# Altium schematic sheet Power_Ctrl.SchDoc
size B
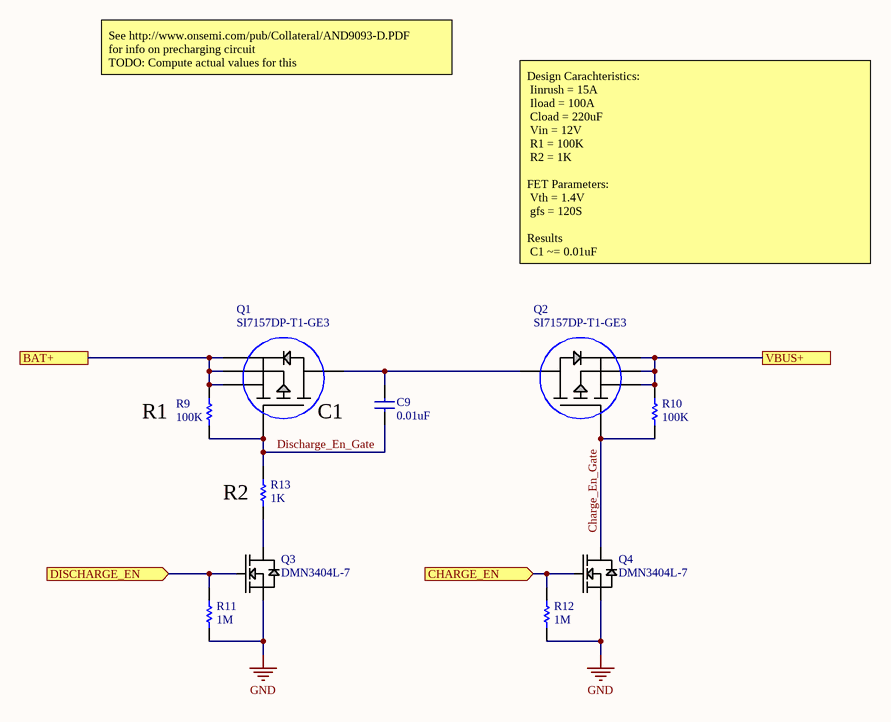
[diagram p0: Power_Ctrl.SchDoc]

## Parts
C9  value 0.01uF  [0805_Capacitor]  (hidden comment: CAP 0.01uF 50V X7R)
Q1  SI7157DP-T1-GE3  [SO-8_PowerPAK(S)]
Q2  SI7157DP-T1-GE3  [SO-8_PowerPAK(S)]
Q3  DMN3404L-7  [SOT23-3]
Q4  DMN3404L-7  [SOT23-3]
R9  value 100K  [0603_RESISTOR]  (hidden comment: R_0603_100K_1%)
R10  value 100K  [0603_RESISTOR]  (hidden comment: R_0603_100K_1%)
R11  value 1M  [0603_RESISTOR]  (hidden comment: R_0603_1M_1%)
R12  value 1M  [0603_RESISTOR]  (hidden comment: R_0603_1M_1%)
R13  value 1K  [0603_RESISTOR]  (hidden comment: R_0603_1K_1%)

## Ports
BAT+, CHARGE_EN (in), DISCHARGE_EN (in), VBUS+

## Nets
GND: Q3.2(SOURCE) Q4.2(SOURCE) R11.1 R12.1
BAT+: Q1.1(SOURCE) Q1.2(SOURCE) Q1.3(SOURCE) R9.2 ; port BAT+
CHARGE_EN: Q4.1(GATE) R12.2 ; port CHARGE_EN
Charge_En_Gate: Q2.4(GATE) Q4.3(DRAIN) R10.2
DISCHARGE_EN: Q3.1(GATE) R11.2 ; port DISCHARGE_EN
Discharge_En_Gate: C9.2 Q1.4(GATE) R9.1 R13.2
VBUS+: Q2.1(SOURCE) Q2.2(SOURCE) Q2.3(SOURCE) R10.1 ; port VBUS+
NetC9_1: C9.1 Q1.5(DRAIN) Q2.5(DRAIN)
NetQ3_3: Q3.3(DRAIN) R13.1

## Notes on the sheet
- See http://www.onsemi.com/pub/Collateral/AND9093-D.PDF
  for info on precharging circuit
  TODO: Compute actual values for this
- Design Carachteristics:
  Iinrush = 15A
  Iload = 100A
  Cload = 220uF
  Vin = 12V
  R1 = 100K
  R2 = 1K
  FET Parameters:
  Vth = 1.4V
  gfs = 120S
  Results
  C1 ~= 0.01uF
- (near R9) R1
- (near Q1) C1
- (near R13) R2

## Library data of the parts
C9 = C_0805_0.01uF_50V_10%: CAP CERM 0.01uF 10% 50V 0805; SVP Creator: Spencer Berglund; Package: =SelectedPackage; Voltage: 50V; Temperature Coefficient: X7R; Supplier 1: Digi-Key; Supplier Part Number 1: 1276-1078-1-ND
Q1 Q2 = Q_SI7157DP-T1-GE3: P-Channel 20V 60A (Tc) 6.25W (Ta), 104W (Tc) Surface Mount PowerPAK® SO-8; Turn-On Delay Time: 20ns; Gate to Source Voltage (Vgs): 12V; Number of Elements: 1; Rise Time: 14ns; Turn-Off Delay Time: 220ns; Drain to Source Resistance: 1.25mR; Drain to Source Breakdown Voltage: -20V; Threshold Voltage: -1.4V; Element Configuration: Single; Rds On Max: 1.6mR; Input Capacitance: 22nF; Fall Time: 55ns; Continuous Drain Current (ID): -60A; Supplier 1: Digi-Key; Supplier Part Number 1: SI7157DP-T1-GE3CT-ND; Number of Pins: 8; Manufacturer Part Number: SI7157DP-T1-GE3; Number of Channels: 1; Max Power Dissipation: 104W; Drain to Source Voltage (Vdss): 20V; Max Operating Temperature: 150°C; Power Dissipation: 6.25W
Q3 Q4 = Q_DMN3404L-7: N-Channel 30V 5.8A (Ta) 720mW (Ta) Surface Mount SOT-23-3; Manufacturer: Diodes; Nominal Vgs: 1.5V; Fall Time: 6.18ns; Turn-Off Delay Time: 13.92ns; Element Configuration: Single; Max Power Dissipation: 1.4W; Turn-On Delay Time: 3.41ns; Gate to Source Voltage (Vgs): 20V; Drain to Source Resistance: 82mR; Input Capacitance: 386pF; On-State Resistance: 28mR; ComponentLink1URL: http://www.st.com/web/en/resource/technical/document/datasheet/CD00001894.pdf; ComponentLink1Description: http://www.st.com/web/en/resource/technical/document/datasheet/CD00001894.pdf; Supplier 1: Digi-Key; Supplier Part Number 1: DMN3404LDICT-ND; Drain to Source Breakdown Voltage: 30V; Max Operating Temperature: 150°C; Drain to Source Voltage (Vdss): 30V; Continuous Drain Current (ID): 5.8A; Rise Time: 6.18ns; Manufacturer Part Number: DMN3404L-7; Case/Package: SOT-23; Min Operating Temperature: -55°C; Power Dissipation: 1.4W; Threshold Voltage: 1.5V; Rds On Max: 28mR
R9 R10 = R_0603_100K_1%: RES 100K OHM 1/16W 1% 0603 SMD; Power Rating: 0.0625W; SVP Creator: Spencer Berglund; Package: 0603_RESISTOR; Supplier 1: Digi-Key; Supplier Part Number 1: 311-100KHRCT-ND
R11 R12 = R_0603_1M_1%: RES 1M OHM 1/16W 1% 0603 SMD; Power Rating: 0.0625W; SVP Creator: Spencer Berglund; Package: 0603_RESISTOR
R13 = R_0603_1K_1%: RES 1K OHM 1/16W 1% 0603 SMD; Power Rating: 0.0625W; SVP Creator: Spencer Berglund; Package: 0603_RESISTOR; Supplier 1: Digi-Key; Supplier Part Number 1: 311-1.00KHRCT-ND